# EAGLE schematic battery-pack-solution (EAGLE 7.1.0)
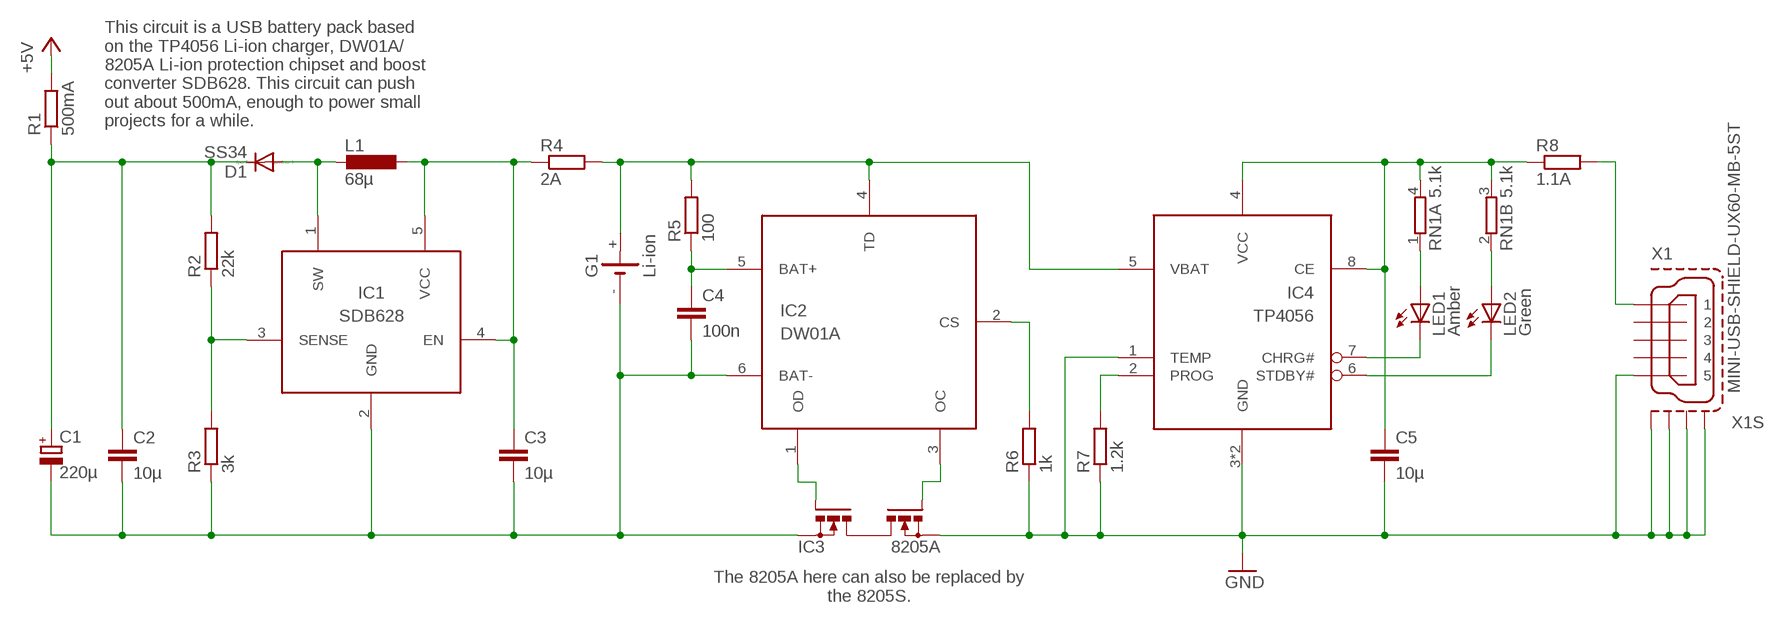
[diagram p0: schematic, sheet 1]

## Parts
C1  220µ  CPOL-EUC  [PANASONIC_C]
C2  10µ  C-EUC0805  [C0805]
C3  10µ  C-EUC0805  [C0805]
C4  100n  C-EUC0603  [C0603]
C5  10µ  C-EUC0805  [C0805]
D1  SS34  DIODE-DO214AC  [DO214AC]
G1  Li-ion  SL-150-1/2AA/PR  [SL-150-1/2AA/PR]
IC1  SDB628  [SOT23-6]
IC2  DW01A  [SOT23-6]
IC3  8205A  [TSSOP8]
IC4  TP4056  [SO-08-EP]
L1  68µ  L-EUL2825P  [L2825P]
LED1  Amber  LEDCHIPLED_0805  [CHIPLED_0805]
LED2  Green  LEDCHIPLED_0805  [CHIPLED_0805]
R1  500mA  R-EU_R1206  [R1206]
R2  22k  R-EU_R0603  [R0603]
R3  3k  R-EU_R0603  [R0603]
R4  2A  R-EU_R1206  [R1206]
R5  100  R-EU_R0603  [R0603]
R6  1k  R-EU_R0603  [R0603]
R7  1.2k  R-EU_R0603  [R0603]
R8  1.1A  R-EU_R1206  [R1206]
RN1  5.1k  2R-NEXB34V  [EXB34V]
X1  MINI-USB-SHIELD-UX60-MB-5ST  [UX60-MB-5ST]

## Nets
+5V: R1.2
GND: C5.2 IC3.2(S1) IC3.3(S1) IC4.1(TEMP) IC4.3(GND) IC4.EP(GND) R6.1 R7.1 X1.5 X1.M1(S1) X1.M2(S2) X1.M3(S3) X1.M4(S4)
N$1: C4.1 IC2.5(BAT+) R5.1
N$2: C5.1 IC4.4(VCC) IC4.8(CE) R8.1 RN1.3 RN1.4
N$3: C1.- C2.2 C3.2 C4.2 G1.- IC1.2(GND) IC2.6(BAT-) IC3.6(S2) IC3.7(S2) R3.1
N$4: IC2.1(OD) IC3.5(G2)
N$5: IC2.3(OC) IC3.4(G1)
N$6: IC2.2(CS) R6.2
N$7: C3.1 IC1.4(EN) IC1.5(VCC) L1.1 R4.1
N$8: LED1.A RN1.1
N$9: LED2.A RN1.2
N$10: IC4.7(CHRG#) LED1.C
N$11: IC4.6(STDBY#) LED2.C
N$12: IC4.2(PROG) R7.2
N$13: IC1.3(SENSE) R2.1 R3.2
N$14: D1.A IC1.1(SW) L1.2
N$15: C1.+ C2.1 D1.C R1.1 R2.2
N$16: R8.2 X1.1
VBAT: G1.+ IC2.4(TD) IC4.5(VBAT) R4.2 R5.2
Unconnected: IC3.1(D) IC3.8(D) X1.2 X1.3 X1.4

## Notes on the sheet
- This circuit is a USB battery pack based
  on the TP4056 Li-ion charger, DW01A/
  8205A Li-ion protection chipset and boost
  converter SDB628. This circuit can push
  out about 500mA, enough to power small
  projects for a while.
- The 8205A here can also be replaced by
  the 8205S.

## Library data of the parts
C1 = rcl:CPOL-EU: POLARIZED CAPACITOR, European symbol
C2-C5 = rcl:C-EU: CAPACITOR, European symbol
D1 = diode:DIODE-: DIODE
G1 = battery:SL-150-1/2AA/PR: LI BATTERY Sonnenschein
IC1 = micwl:SDB628: SDB628 1.2MHz switch-ode boost converter Vsense = 0.6V
IC2 = micwl:DW01A: DW10A Lithium-Ion Battery protection IC
IC3 = micwl:8205A: FS8205A Dual Power MOSFET, common drain This transistor is the standard match for DW01A battery protection IC. See included application schematic.
IC4 = micwl:TP4056
L1 = rcl:L-EU: INDUCTOR, European symbol
LED1 LED2 = led:LED: LED OSRAM: - CHIPLED LG R971, LG N971, LY N971, LG Q971, LY Q971, LO R971, LY R971 LH N974, LH R974 LS Q976, LO Q976, LY Q976 LO Q996 - Hyper CHIPLED LW Q18S LB Q993, LB Q99A, LB R99A - SideLED LS A670, LO A670, LY A670, LG A670, LP A670 LB A673, LV A673, LT A673, LW A673 LH A674 LY A675 LS A676, LA A676, LO A676, LY A676, LW A676 LS A679, LY A679, LG A679 - Hyper Micro SIDELED® LS Y876, LA Y876, LO Y876, LY Y876 LT Y87S - SmartLED LW L88C, LW L88S LB L89C, LB L89S, LG L890 LS L89K, LO L89K, LY L89K LS L896, LA L896, LO L896, LY L896 - TOPLED LS T670, LO T670, LY T670, LG T670, LP T670 LSG T670, LSP T670, LSY T670, LOP T670, LYG T670 LG T671, LOG T671, LSG T671 LB T673, LV T673, LT T673, LW T673 LH T674 LS T676, LA T676, LO T676, LY T676, LB T676, LH T676, LSB T676, LW T676 LB T67C, LV T67C, LT T67C, LS T67K, LO T67K, LY T67K, LW E67C LS E67B, LA E67B, LO E67B, LY E67B, LB E67C, LV E67C, LT E67C LW T67C LS T679, LY T679, LG T679 LS T770, LO T770, LY T770, LG T770, LP T770 LB T773, LV T773, LT T773, LW T773 LH T774 LS E675, LA E675, LY E675, LS T675 LS T776, LA T776, LO T776, LY T776, LB T776 LHGB T686 LT T68C, LB T68C - Hyper Mini TOPLED® LB M676 - Mini TOPLED Santana® LG M470 LS M47K, LO M47K, LY M47K Source: http://www.osram.convergy.de LUXEON: - LUMILED® LXK2-PW12-R00, LXK2-PW12-S00, LXK2-PW14-U00, LXK2-PW14-V00 LXK2-PM12-R00, LXK2-PM12-S00, LXK2-PM14-U00 LXK2-PE12-Q00, LXK2-PE12-R00, LXK2-PE12-S00, LXK2-PE14-T00, LXK2-PE14-U00 LXK2-PB12-K00, LXK2-PB12-L00, LXK2-PB12-M00, LXK2-PB14-N00, LXK2-PB14-P00, LXK2-PB14-Q00 LXK2-PR12-L00, LXK2-PR12-M00, LXK2-PR14-Q00, LXK2-PR14-R00 LXK2-PD12-Q00, LXK2-PD12-R00, LXK2-PD12-S00 LXK2-PH12-R00, LXK2-PH12-S00 LXK2-PL12-P00, LXK2-PL12-Q00, LXK2-PL12-R00 Source: www.luxeon.com KINGBRIGHT: KA-3528ASYC Source: www.kingbright.com
R1-R8 = rcl:R-EU_: RESISTOR, European symbol
RN1 = resistor-dil:2R-N: Array Chip Resistor Source: Panasonic; OC_FARNELL: unknown; OC_NEWARK: unknown
X1 = con-hirose:MINI-USB-SHIELD-: MINI USB Connector Source: http://www.hirose.co.jp/cataloge_hp/e24000019.pdf; OC_FARNELL: unknown; OC_NEWARK: unknown